# EAGLE design on-connector PCB (EAGLE 7.1.0)
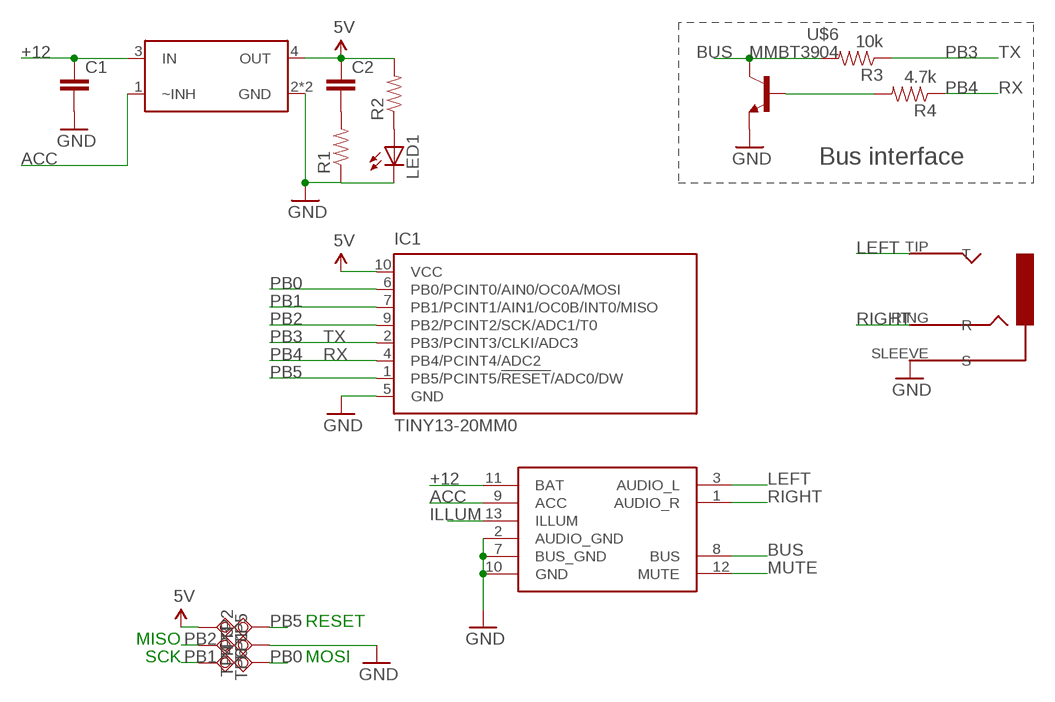
[diagram p0: schematic, sheet 1]

## Parts
C1  CAP0603-CAP  [0603-CAP]
C2  CAP0603-CAP  [0603-CAP]
IC1  TINY13-20MM0  [10M1]
LED1  LED0603  [LED-0603]
R1  RESISTOR0603-RES  [0603-RES]
R2  RESISTOR0603-RES  [0603-RES]
R3  10k  RESISTOR0805-RES  [0805]
R4  4.7k  RESISTOR0805-RES  [0805]
TP1  TPSQTP07R  [TP07R]
TP2  TPSQTP07R  [TP07R]
TP3  TPSQTP07R  [TP07R]
TP4  TPSQTP07R  [TP07R]
TP5  TPSQTP07SQ  [TP07SQ]
TP6  TPSQTP07R  [TP07R]
U$1  PANASONIC_CN702_BACKBOARD  [040_MLCII_BACK_CN702]
U$2  STEREO_JACK_SJ_352X  [AUDIO-JACK-3.5MM-SMD]
U$6  MMBT3904  [SOT23-3]
U$7  IFX20001  [PG-SCT595-5]

## Nets
5V: C2.1 IC1.10(VCC) R2.2 TP5.TP U$7.4(OUT)
+12: C1.1 U$1.11(BAT) U$7.3(IN)
ACC: U$1.9(ACC) U$7.1(~INH)
BUS: R3.2 U$1.8(BUS) U$6.3(C)
GND: C1.2 IC1.5(GND) LED1.C R1.1 TP3.TP U$1.2(AUDIO_GND) U$1.7(BUS_GND) U$1.10(GND) U$2.SLEEVE(S) U$6.2(E) U$7.2(GND) U$7.5(GND)
ILLUM: U$1.13(ILLUM)
LEFT: U$1.3(AUDIO_L) U$2.TIP(T)
MUTE: U$1.12(MUTE)
N$1: C2.2 R1.2
N$2: LED1.A R2.1
N$20: R4.2 U$6.1(B)
PB0: IC1.6(PB0/PCINT0/AIN0/OC0A/MOSI) TP4.TP
PB1: IC1.7(PB1/PCINT1/AIN1/OC0B/INT0/MISO) TP6.TP
PB2: IC1.9(PB2/PCINT2/SCK/ADC1/T0) TP1.TP
PB3: IC1.2(PB3/PCINT3/CLKI/ADC3) R3.1
PB4: IC1.4(PB4/PCINT4/ADC2) R4.1
PB5: IC1.1(PB5/PCINT5/!RESET!/ADC0/DW) TP2.TP
RIGHT: U$1.1(AUDIO_R) U$2.RING(R)

## Notes on the sheet
- TX
- RX
- Bus interface
- TX
- RX
- RESET
- MISO
- SCK | MOSI

## Power pins joined to a net without a drawn wire
GND: IC1.11(GND)

## Library data of the parts
C1 C2 = SparkFun-Capacitors:CAP: Capacitor Standard 0603 ceramic capacitor, and 0.1" leaded capacitor.
IC1 = atmel:TINY13*: 8-bit AVR Microcontroller with 1K Bytes In-System Programmable Flash Source: http://www.atmel.com/dyn/resources/prod_documents/2535S.pdf; MPN: ATTINY13A-MMU; OC_FARNELL: 1715516; OC_NEWARK: 15R0298
LED1 = SparkFun-LED:LED: LEDs Standard schematic elements and footprints for 5mm, 3mm, 1206, and 0603 sized LEDs. 5mm - Spark Fun Electronics SKU : COM-00529 (and others)
R1-R4 = SparkFun-Resistors:RESISTOR: Resistor Basic schematic elements and footprints for 0603, 1206, and PTH resistors.
TP1-TP6 = testpad:TPSQ: Test pad
U$1 = personal:PANASONIC_CN702_BACKBOARD
U$2 = personal:STEREO_JACK
U$6 = personal:MMBT3904
U$7 = personal:IFX20001

## Board
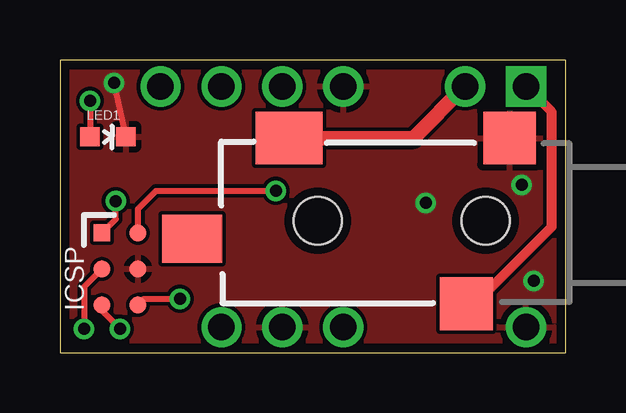
[diagram p1: board, top side]
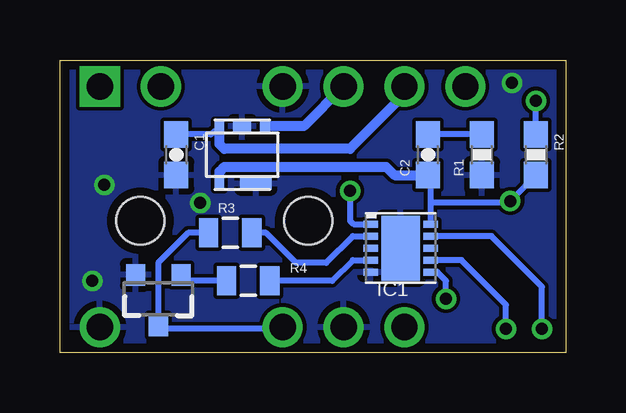
[diagram p2: board, bottom side, seen from below]

Size 21.1 x 12.2 mm. Coordinates in mm from the lower left corner, seen from the top.
Copper layers (1*16): Top 0.0356mm / dielectric 1.5011mm / Bottom 0.0356mm
Design rules "LaenPCBOrder": minimum track width 6mil, minimum drill 13mil, track to track 6mil, track to pad 6mil, pad to pad 6mil, via to via 6mil, smd to smd 6mil, copper to edge 15mil, drill to drill 6mil, minimum pad ring 7mil, minimum via ring 7mil, stop-mask expansion 3mil, vias tented up to drill 0mil, thermal gap 10mil

### Footprints (pad centres in the part's own frame; a part is rotated, then mirrored left to right if it is on the bottom)
0603-CAP = smd 1.1 x 1: 1 -0.85,0; 2 0.85,0
10M1 = smd 0.6 x 0.3: 1 -1.25,1; 2 -1.25,0.5; 3 -1.25,0; 4 -1.25,-0.5; 5 -1.25,-1; 6 1.25,-1; 7 1.25,-0.5; 8 1.25,0; 9 1.25,0.5; 10 1.25,1 | smd 1.6 x 2.7: 11 0,0
LED-0603 = smd 0.8 x 0.8: A 0,-0.75; C 0,0.75
0603-RES = smd 1.1 x 1: 1 -0.85,0; 2 0.85,0
0805 = smd 0.8 x 1.2: 1 -0.9,0; 2 0.9,0
TP07R = smd 0.7 x 0.7: TP 0,0
TP07SQ = smd 0.7 x 0.7: TP 0,0
040_MLCII_BACK_CN702 = drill 1.1 pad 1.676 square: 1 19.435,11.1 | drill 1.1 pad 1.676: 2 19.435,1.07; 3 16.895,11.1; 7 11.815,11.1; 8 11.815,1.07; 9 9.275,11.1; 10 9.275,1.07; 11 6.735,11.1; 12 6.735,1.07; 13 4.195,11.1
AUDIO-JACK-3.5MM-SMD = smd 2.2 x 2.2: RING 4.3,3.45; SLEEVE 2.5,-3.45 | smd 2.8 x 2.2: TIP 11.7,-3.45 | smd 2.5 x 2: TSH 15.75,0.75 | hole 2: 3.5,0; 10.5,0
SOT23-3 = smd 0.8 x 0.9: 1 -0.95,-1; 2 0.95,-1; 3 0,1.1
PG-SCT595-5 = smd 0.4 x 0.5: 1 -0.95,-1.2; 3 0.95,-1.2; 4 0.95,1.2 | smd 0.75 x 0.5: 2 0,-1.2 | smd 1.3 x 0.5: 5 -0.57,1.2

### Placement (x,y rotation side)
C1  16.25,8.25 270 bottom
C2  5.75,8.25 90 bottom
IC1  6.9,4.36 0 bottom
LED1  2,9 270 top
R1  3.5,8.25 90 bottom
R2  1.25,8.25 270 bottom
R3  14,5 180 bottom
R4  13.25,3 180 bottom
TP1  1.75,3.5 90 top
TP2  3.25,5 90 top
TP3  3.25,3.5 270 top
TP4  3.25,2 270 top
TP5  1.75,5 270 top
TP6  1.75,2 90 top
U$1  0,0 0 top
U$2  21.25,5.5 180 top
U$6  17,2.25 180 bottom
U$7  13.5,8.25 180 bottom

### Tracks (layer width: path | path; a pad name or v marks a point on that pad's centre or on a via)
5V  (via drill 0.5)
  Top 0.254: TP5.TP 2.33,5.58 v2.33,6.33
  Bottom 0.254: C2.1 5.9,7.25 5.65,7 5.65,6.25 | 5.65,6.25 IC1.10 | R2.2 2.2,6.45 v2.33,6.33 2.4,6.25 5.65,6.25
  Bottom 0.406: U$7.4 14.45,7.55 14.25,7.75 7.5,7.75 7.15,7.4 C2.1
+12
  Top 0.61: U$1.11 6.74,10.84
  Bottom 0.254: U$7.3 14.8,9.1 C1.1
  Bottom 0.406: U$1.11 6.74,10.77 9,8.5 14.25,8.5 14.45,8.7 U$7.3
ACC
  Bottom 0.406: U$1.9 10.93,9.45 U$7.1
BUS
  Bottom 0.254: U$1.8 12,1 16.9,1 U$6.3 17,3.75 15.75,5 R3.2
GND  (via drill 0.5)
  Top 0.254: LED1.C v2.25,11.25
  other vias: 19.25,7 19.75,3 15.25,6.25
  pour Bottom (rank 2): 0,12.25 21.25,12.25 21.25,0 0,0
  pour Top: 0,12.25 21.25,12.25 21.25,0 0,0
LEFT
  Top 0.61: U$2.TIP 14.74,8.95 U$1.3
N$1
  Bottom 0.254: R1.2 C2.2
N$2  (via drill 0.5)
  Top 0.254: v1.25,10.5 LED1.A
  Bottom 0.254: R2.1 v1.25,10.5
N$20
  Bottom 0.254: R4.2 16.05,3 U$6.1
PB0  (via drill 0.5)
  Top 0.254: TP4.TP 3.5,2.25 v5,2.25
  Bottom 0.254: v5,2.25 5,3 5.36,3.36 IC1.6
PB1  (via drill 0.5)
  Top 0.254: TP6.TP 1.75,1.75 v2.5,1
  Bottom 0.254: v2.5,1 2.5,2 4.36,3.86 IC1.7
PB2  (via drill 0.5)
  Top 0.254: TP1.TP 1,2.75 v1,1
  Bottom 0.254: v1,1 1,2.75 3.11,4.86 4.86,4.86 IC1.9
PB3
  Bottom 0.254: R3.1 12.5,5 11.25,3.75 10,3.75 8.89,4.86 IC1.2
PB4
  Bottom 0.254: R4.1 9.75,3 8.89,3.86 IC1.4
PB5  (via drill 0.5)
  Top 0.254: v9,6.75 4,6.75 3.25,6 TP2.TP
  Bottom 0.254: v9,6.75 9,5.5 8.86,5.36 IC1.1
RIGHT
  Top 0.406: 17.3,2.05 20.5,5.25 20.5,10.04 U$1.1
  Top 0.813: U$2.RING 17.3,2.05

### Text on the board
tNames: ICSP